# Altium schematic sheet CLKB_uplinks.SchDoc
size A3
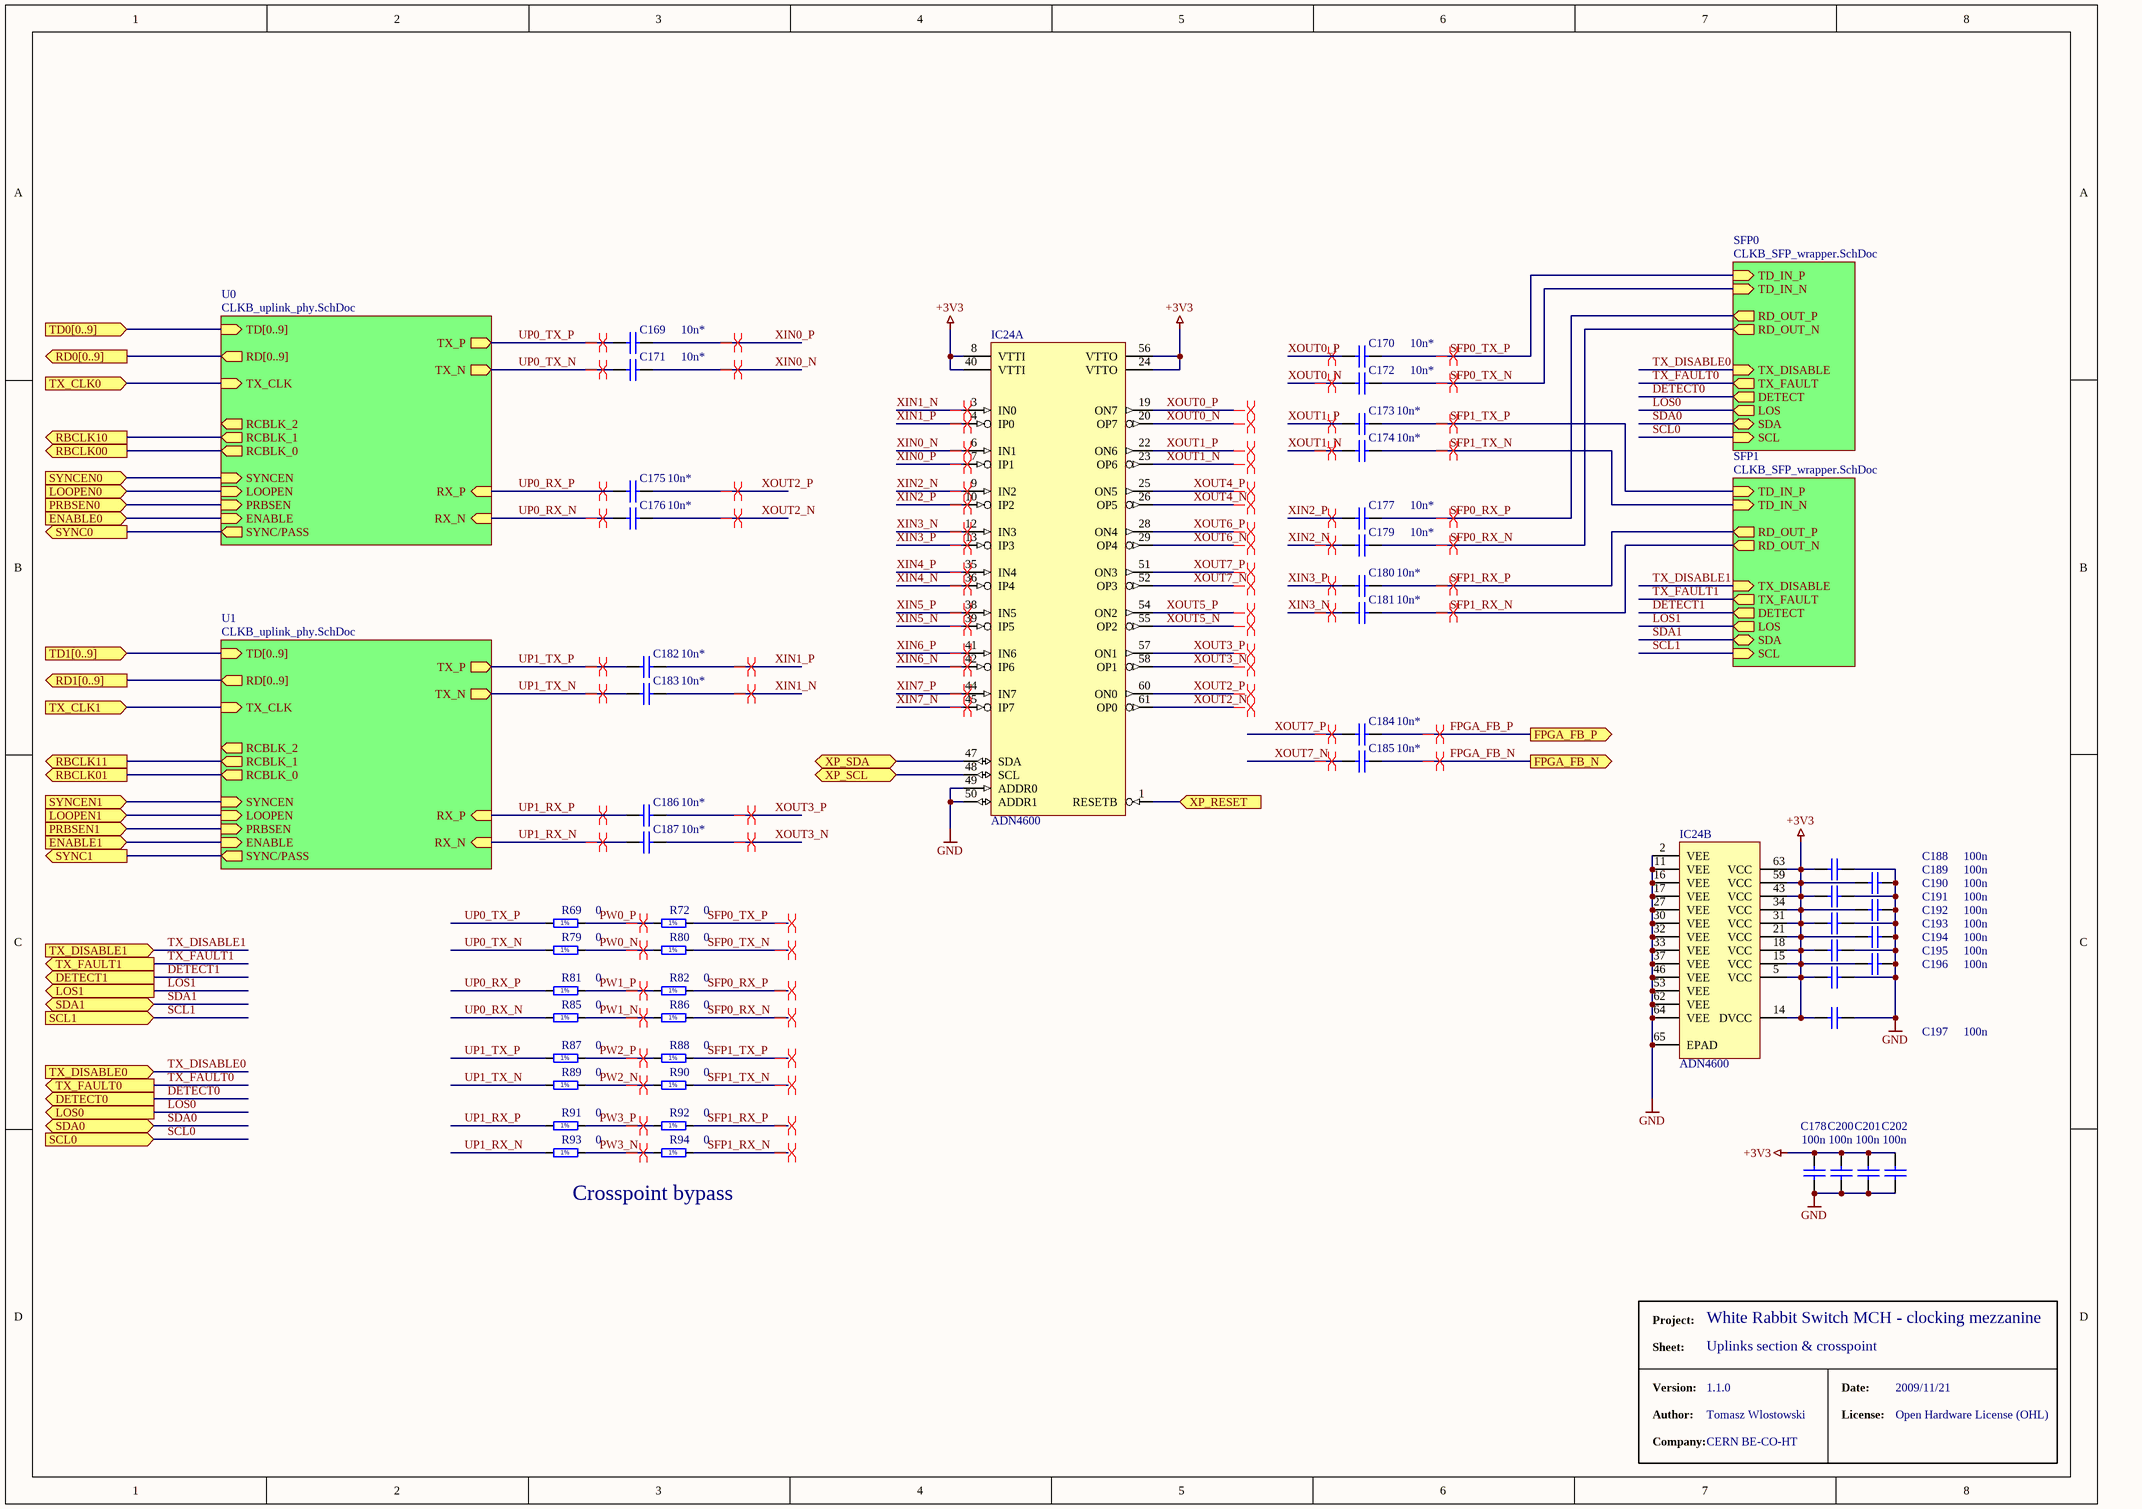
[diagram p0: CLKB_uplinks.SchDoc]

## Parts
C169  10n*  [CAPC1005X55N]
C170  10n*  [CAPC1005X55N]
C171  10n*  [CAPC1005X55N]
C172  10n*  [CAPC1005X55N]
C173  10n*  [CAPC1005X55N]
C174  10n*  [CAPC1005X55N]
C175  10n*  [CAPC1005X55N]
C176  10n*  [CAPC1005X55N]
C177  10n*  [CAPC1005X55N]
C178  100n  [CAPC1005X55N]
C179  10n*  [CAPC1005X55N]
C180  10n*  [CAPC1005X55N]
C181  10n*  [CAPC1005X55N]
C182  10n*  [CAPC1005X55N]
C183  10n*  [CAPC1005X55N]
C184  10n*  [CAPC1005X55N]
C185  10n*  [CAPC1005X55N]
C186  10n*  [CAPC1005X55N]
C187  10n*  [CAPC1005X55N]
C188  100n  [CAPC1005X55N]
C189  100n  [CAPC1005X55N]
C190  100n  [CAPC1005X55N]
C191  100n  [CAPC1005X55N]
C192  100n  [CAPC1005X55N]
C193  100n  [CAPC1005X55N]
C194  100n  [CAPC1005X55N]
C195  100n  [CAPC1005X55N]
C196  100n  [CAPC1005X55N]
C197  100n  [CAPC1005X55N]
C200  100n  [CAPC1005X55N]
C201  100n  [CAPC1005X55N]
C202  100n  [CAPC1005X55N]
IC24  ADN4600  [LFCSP64_ADN4600]  (parts A,B of 2)
R69  0  [RESC1005X40N]
R72  0  [RESC1005X40N]
R79  0  [RESC1005X40N]
R80  0  [RESC1005X40N]
R81  0  [RESC1005X40N]
R82  0  [RESC1005X40N]
R85  0  [RESC1005X40N]
R86  0  [RESC1005X40N]
R87  0  [RESC1005X40N]
R88  0  [RESC1005X40N]
R89  0  [RESC1005X40N]
R90  0  [RESC1005X40N]
R91  0  [RESC1005X40N]
R92  0  [RESC1005X40N]
R93  0  [RESC1005X40N]
R94  0  [RESC1005X40N]

## Sub-sheets
SFP0 = CLKB_SFP_wrapper.SchDoc: TX_FAULT (out), TX_DISABLE (in), SDA (bidir), SCL (in), DETECT (out), LOS (out), RD_OUT_N (out), RD_OUT_P (out), TD_IN_N (in), TD_IN_P (in)
SFP1 = CLKB_SFP_wrapper.SchDoc: TX_FAULT (out), TX_DISABLE (in), SDA (bidir), SCL (in), DETECT (out), LOS (out), RD_OUT_N (out), RD_OUT_P (out), TD_IN_N (in), TD_IN_P (in)
U0 = CLKB_uplink_phy.SchDoc: TD[0..9] (in), SYNCEN (in), LOOPEN (in), PRBSEN (in), ENABLE (in), SYNC/PASS (out), RD[0..9] (out), TX_CLK (in), TX_N (out), TX_P (out), RX_P (in), RX_N (in), RCBLK_0 (out), RCBLK_1 (out), RCBLK_2 (out)
U1 = CLKB_uplink_phy.SchDoc: TD[0..9] (in), SYNCEN (in), LOOPEN (in), PRBSEN (in), ENABLE (in), SYNC/PASS (out), RD[0..9] (out), TX_CLK (in), TX_N (out), TX_P (out), RX_P (in), RX_N (in), RCBLK_0 (out), RCBLK_1 (out), RCBLK_2 (out)

## Ports
DETECT0 (out), DETECT1 (out), ENABLE0 (in), ENABLE1 (in), FPGA_FB_N (out), FPGA_FB_P (out), LOOPEN0 (in), LOOPEN1 (in), LOS0 (out), LOS1 (out), PRBSEN0 (in), PRBSEN1 (in), RBCLK00 (out), RBCLK01 (out), RBCLK10 (out), RBCLK11 (out), RD0[0..9] (out), RD1[0..9] (out), SCL0 (in), SCL1 (in), SDA0 (bidir), SDA1 (bidir), SYNC0 (out), SYNC1 (out), SYNCEN0 (in), SYNCEN1 (in), TD0[0..9] (in), TD1[0..9] (in), TX_CLK0 (in), TX_CLK1 (in), TX_DISABLE0 (in), TX_DISABLE1 (in), TX_FAULT0 (out), TX_FAULT1 (out), XP_RESET (in), XP_SCL (bidir), XP_SDA (bidir)

## Nets
+3V3: C178.2 C188.1 C189.1 C190.1 C191.1 C192.1 C193.1 C194.1 C195.1 C196.1 C197.1 C200.2 C201.2 C202.2 IC24.5(VCC) IC24.8(VTTI) IC24.14(DVCC) IC24.15(VCC) IC24.18(VCC) IC24.21(VCC) IC24.24(VTTO) IC24.31(VCC) IC24.34(VCC) IC24.40(VTTI) IC24.43(VCC) IC24.56(VTTO) IC24.59(VCC) IC24.63(VCC)
GND: C178.1 C188.2 C189.2 C190.2 C191.2 C192.2 C193.2 C194.2 C195.2 C196.2 C197.2 C200.1 C201.1 C202.1 IC24.2(VEE) IC24.11(VEE) IC24.16(VEE) IC24.17(VEE) IC24.27(VEE) IC24.30(VEE) IC24.32(VEE) IC24.33(VEE) IC24.37(VEE) IC24.46(VEE) IC24.49(ADDR0) IC24.50(ADDR1) IC24.53(VEE) IC24.62(VEE) IC24.64(VEE) IC24.65(EPAD)
DETECT0: port DETECT0, sheet SFP0/DETECT
DETECT1: port DETECT1, sheet SFP1/DETECT
ENABLE0: port ENABLE0, sheet U0/ENABLE
ENABLE1: port ENABLE1, sheet U1/ENABLE
FPGA_FB_N: C185.2 ; port FPGA_FB_N
FPGA_FB_P: C184.2 ; port FPGA_FB_P
LOOPEN0: port LOOPEN0, sheet U0/LOOPEN
LOOPEN1: port LOOPEN1, sheet U1/LOOPEN
LOS0: port LOS0, sheet SFP0/LOS
LOS1: port LOS1, sheet SFP1/LOS
PRBSEN0: port PRBSEN0, sheet U0/PRBSEN
PRBSEN1: port PRBSEN1, sheet U1/PRBSEN
PW0_N: R79.2 R80.1
PW0_P: R69.2 R72.1
PW1_N: R85.2 R86.1
PW1_P: R81.2 R82.1
PW2_N: R89.2 R90.1
PW2_P: R87.2 R88.1
PW3_N: R93.2 R94.1
PW3_P: R91.2 R92.1
RBCLK00: port RBCLK00, sheet U0/RCBLK_0
RBCLK01: port RBCLK01, sheet U1/RCBLK_0
RBCLK10: port RBCLK10, sheet U0/RCBLK_1
RBCLK11: port RBCLK11, sheet U1/RCBLK_1
SCL0: port SCL0, sheet SFP0/SCL
SCL1: port SCL1, sheet SFP1/SCL
SDA0: port SDA0, sheet SFP0/SDA
SDA1: port SDA1, sheet SFP1/SDA
SFP0_RX_N: C179.2 R86.2 ; sheet SFP0/RD_OUT_N
SFP0_RX_P: C177.2 R82.2 ; sheet SFP0/RD_OUT_P
SFP0_TX_N: C172.2 R80.2 ; sheet SFP0/TD_IN_N
SFP0_TX_P: C170.2 R72.2 ; sheet SFP0/TD_IN_P
SFP1_RX_N: C181.2 R94.2 ; sheet SFP1/RD_OUT_N
SFP1_RX_P: C180.2 R92.2 ; sheet SFP1/RD_OUT_P
SFP1_TX_N: C174.2 R90.2 ; sheet SFP1/TD_IN_N
SFP1_TX_P: C173.2 R88.2 ; sheet SFP1/TD_IN_P
SYNC0: port SYNC0, sheet U0/SYNC/PASS
SYNC1: port SYNC1, sheet U1/SYNC/PASS
SYNCEN0: port SYNCEN0, sheet U0/SYNCEN
SYNCEN1: port SYNCEN1, sheet U1/SYNCEN
TX_CLK0: port TX_CLK0, sheet U0/TX_CLK
TX_CLK1: port TX_CLK1, sheet U1/TX_CLK
TX_DISABLE0: port TX_DISABLE0, sheet SFP0/TX_DISABLE
TX_DISABLE1: port TX_DISABLE1, sheet SFP1/TX_DISABLE
TX_FAULT0: port TX_FAULT0, sheet SFP0/TX_FAULT
TX_FAULT1: port TX_FAULT1, sheet SFP1/TX_FAULT
UP0_RX_N: C176.1 R85.1 ; sheet U0/RX_N
UP0_RX_P: C175.1 R81.1 ; sheet U0/RX_P
UP0_TX_N: C171.1 R79.1 ; sheet U0/TX_N
UP0_TX_P: C169.1 R69.1 ; sheet U0/TX_P
UP1_RX_N: C187.1 R93.1 ; sheet U1/RX_N
UP1_RX_P: C186.1 R91.1 ; sheet U1/RX_P
UP1_TX_N: C183.1 R89.1 ; sheet U1/TX_N
UP1_TX_P: C182.1 R87.1 ; sheet U1/TX_P
XIN0_N: C171.2 IC24.6(IN1)
XIN0_P: C169.2 IC24.7(IP1)
XIN1_N: C183.2 IC24.3(IN0)
XIN1_P: C182.2 IC24.4(IP0)
XIN2_N: C179.1 IC24.9(IN2)
XIN2_P: C177.1 IC24.10(IP2)
XIN3_N: C181.1 IC24.12(IN3)
XIN3_P: C180.1 IC24.13(IP3)
XIN4_N: IC24.36(IP4)
XIN4_P: IC24.35(IN4)
XIN5_N: IC24.39(IP5)
XIN5_P: IC24.38(IN5)
XIN6_N: IC24.42(IP6)
XIN6_P: IC24.41(IN6)
XIN7_N: IC24.45(IP7)
XIN7_P: IC24.44(IN7)
XOUT0_N: C172.1 IC24.20(OP7)
XOUT0_P: C170.1 IC24.19(ON7)
XOUT1_N: C174.1 IC24.23(OP6)
XOUT1_P: C173.1 IC24.22(ON6)
XOUT2_N: C176.2 IC24.61(OP0)
XOUT2_P: C175.2 IC24.60(ON0)
XOUT3_N: C187.2 IC24.58(OP1)
XOUT3_P: C186.2 IC24.57(ON1)
XOUT4_N: IC24.26(OP5)
XOUT4_P: IC24.25(ON5)
XOUT5_N: IC24.55(OP2)
XOUT5_P: IC24.54(ON2)
XOUT6_N: IC24.29(OP4)
XOUT6_P: IC24.28(ON4)
XOUT7_N: C185.1 IC24.52(OP3)
XOUT7_P: C184.1 IC24.51(ON3)
XP_RESET: IC24.1(RESETB) ; port XP_RESET
XP_SCL: IC24.48(SCL) ; port XP_SCL
XP_SDA: IC24.47(SDA) ; port XP_SDA

## Buses and harness runs
bus port RD0[0..9] = sheet U0/RD[0..9]
bus port RD1[0..9] = sheet U1/RD[0..9]
bus port TD0[0..9] = sheet U0/TD[0..9]
bus port TD1[0..9] = sheet U1/TD[0..9]

## Layout directives
differential pair: FPGA_FB_N, FPGA_FB_P, PW0_N, PW0_P, PW1_N, PW1_P, PW2_N, PW2_P, PW3_N, PW3_P, SFP0_RX_N, SFP0_RX_P, SFP0_TX_N, SFP0_TX_P, SFP1_RX_N, SFP1_RX_P, SFP1_TX_N, SFP1_TX_P, UP0_RX_N, UP0_RX_P, UP0_TX_N, UP0_TX_P, UP1_RX_N, UP1_RX_P, UP1_TX_N, UP1_TX_P, XIN0_N, XIN0_P, XIN1_N, XIN1_P, XIN2_N, XIN2_P, XIN3_N, XIN3_P, XIN4_N, XIN4_P, XIN5_N, XIN5_P, XIN6_N, XIN6_P, XIN7_N, XIN7_P, XOUT0_N, XOUT0_P, XOUT1_N, XOUT1_P, XOUT2_N, XOUT2_P, XOUT3_N, XOUT3_P, XOUT4_N, XOUT4_P, XOUT5_N, XOUT5_P, XOUT6_N, XOUT6_P, XOUT7_N, XOUT7_P

## Notes on the sheet
- Crosspoint bypass
- Project:
- White Rabbit Switch MCH - clocking mezzanine
- Sheet:
- Version:
- Uplinks section & crosspoint
- 1.1.0
- Date:
- 2009/11/21
- Author:
- Company:
- Tomasz Wlostowski
- CERN BE-CO-HT
- License:
- Open Hardware License (OHL)
- (in symbol R0402_0R_JUMPER) 1%

## Library data of the parts
C169-C177 C179-C187 = CC0402_10NF_16V_10%_X7R: Non-polarised capacitor; Part Description: SMD Multilayer Chip Ceramic Capacitor; Manufacturer: GENERIC; Manufacturer1 Part Number: 223878715636; Manufacturer1 Datasheet: \\cern.ch\dfs\Applications\Altium\Datasheets\CC0402_X7R_PHYCOMP.pdf; Value: 10nF; Voltage: 16V; TC: X7R; Tolerance: ±10%; Table: Capacitors SMD; Part Number: CC0402_10NF_16V_10%_X7R; Component Kind: Standard; Component Type: Standard; Designator: Capacitor - non polarized; Library Reference: Capacitor - non polarized; Pin Count: 2; Status: Not Recommended; Manufacturer Part Number: CC0402_10NF_16V_10%_X7R; Case: 0402; Mounted: Yes; Socket: No; SMD: Yes; Manufacturer1 Example: PHYCOMP; Manufacturer1 ComponentHeight: 0.55mm; HelpURL: \\cern.ch\dfs\Applications\Altium\Datasheets\CC0402_X7R_PHYCOMP.pdf; Author: CERN DEM JLC; CreateDate: 2007-12-03; LatestRevisionDate: 2007-12-03
C178 C188-C197 C200-C202 = CC0402_100NF_16V_10%_X7R: Non-polarised capacitor; Part Description: SMD Multilayer Chip Ceramic Capacitor; Manufacturer: GENERIC; Manufacturer1 Part Number: 223878715649; Manufacturer1 Datasheet: \\cern.ch\dfs\Applications\Altium\Datasheets\CC0402_X7R_PHYCOMP.pdf; Value: 100nF; Voltage: 16V; TC: X7R; Tolerance: ±10%; Table: Capacitors SMD; Part Number: CC0402_100NF_16V_10%_X7R; Component Kind: Standard; Component Type: Standard; Designator: Capacitor - non polarized; Library Reference: Capacitor - non polarized; Pin Count: 2; Status: Not Recommended; Manufacturer Part Number: CC0402_100NF_16V_10%_X7R; Case: 0402; Mounted: Yes; Socket: No; SMD: Yes; Manufacturer1 Example: PHYCOMP; Manufacturer1 ComponentHeight: 0.55mm; HelpURL: \\cern.ch\dfs\Applications\Altium\Datasheets\CC0402_X7R_PHYCOMP.pdf; Author: CERN DEM JLC; CreateDate: 2007-12-03; LatestRevisionDate: 2007-12-03
IC24 = ADN4600: Gigabit 8x8 crosspoint switch
R69 R72 R79-R82 R85-R94 = R0402_0R_JUMPER: Resistor - 1%; Part Description: 1A (0.05R Max DC Resistance) Zero Ohm Jumper; Manufacturer: GENERIC; Manufacturer1 Part Number: 232270591001; Manufacturer1 Datasheet: \\cern.ch\dfs\Applications\Altium\Datasheets\R0402_Phycomp_RC0402.pdf; Table: Resistors SMD; Part Number: R0402_0R_JUMPER; Component Kind: Standard; Component Type: Standard; Designator: Resistor - 1%; Library Reference: Resistor - 1%; Pin Count: 2; Value: 0; Status: Not recommended; Manufacturer Part Number: R0402_0R_JUMPER; Case: 0402; Mounted: Yes; Socket: No; SMD: Yes; Manufacturer1 Example: PHYCOMP; Manufacturer1 ComponentHeight: 0.4mm; HelpURL: \\cern.ch\dfs\Applications\Altium\Datasheets\R0402_Phycomp_RC0402.pdf; Author: CERN DEM JLC; CreateDate: 2007-12-03; LatestRevisionDate: 2008-03-13